# Altium schematic sheet Mosfets.SchDoc
size A4; SheetNumber: 9; SheetTotal: 11
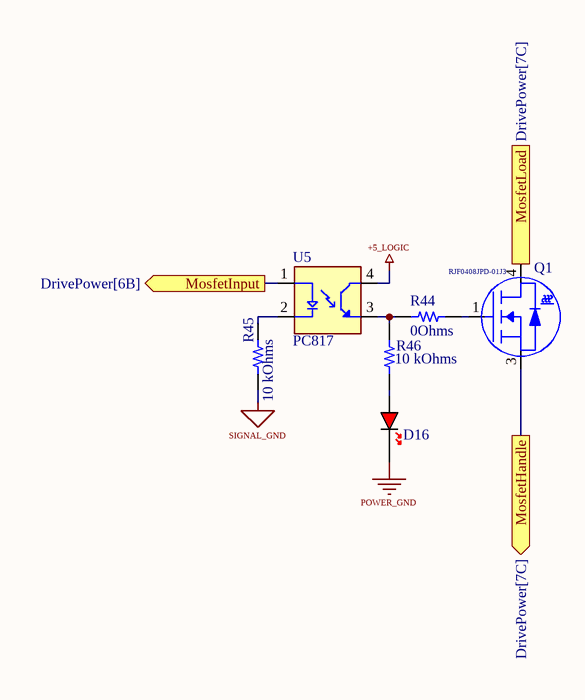
[diagram p0: Mosfets.SchDoc]

## Parts
D16  RED  [LED_0603_RED]  (value not drawn)
Q1  RJF0408JPD-01J3  [DPAKS_SC-63_PRSS0004ZD-C_REN]
R44  0Ohms  [RES 0805_2012]
R45  10 kOhms  [RES 0805_2012]
R46  10 kOhms  [RES 0805_2012]
U5  PC817  [PC817]

## Ports
MosfetHandle (out, see DrivePower[7C]), MosfetInput (out, see DrivePower[6B]), MosfetLoad (in, see DrivePower[7C])

## Nets
+5_LOGIC: U5.4(CT)
POWER_GND: D16.K
SIGNAL_GND: R45.1
MosfetHandle: Q1.3(SOURCE) ; port MosfetHandle
MosfetInput: U5.1(A) ; port MosfetInput
MosfetLoad: Q1.4(DRAIN) ; port MosfetLoad
NetD16_A: D16.A R46.1
NetQ1_1: Q1.1(GATE) R44.2
NetR44_1: R44.1 R46.2 U5.3(ET)
NetR45_2: R45.2 U5.2(C)

## Library data of the parts
D16 = LED_0603_RED: Yellow Plox
Q1 = RJF0408JPD-01J3: No Description Available; Mfr_Name: Renesas Electronics; RefDes: RefDes; Type: Type
R44 = JR0805X35E: 0805 35 AMP JUMPER; Manufacturer: Ohmite; Power (Watts): 0.245W; Part Number: JR0805X35E; Value: 0Ohms; ComponentLink1Description: Datasheet; ComponentLink1URL: https://www.ohmite.com/assets/docs/res_jr.pdf?r=false; ComponentLink2Description: DigiKey Link; ComponentLink2URL: https://www.digikey.com/en/products/detail/ohmite/JR0805X35E/10233372; Composition: Metal Element; Device Package: 0805 (2012 Metric); Height - Seated (Max): 0.022" (0.55mm); LastUpdated: 08/02/2024 21:02:32; Lifecycle Status: Active; Minimum Order: 1; Number of Terminations: 2; Operating Temperature: -55°C ~ 150°C; Package / Case: 0805 (2012 Metric); Packaging: TapeAndReel; PartId: 29311; Part Status: Active; Price: 0.06; Resistance: 0 Ohms; Series: JR; Size / Dimension: 0.079" L x 0.049" W (2.00mm x 1.25mm); Supplier 1: DigiKey; Supplier Part Number 1: JR0805X35ECT-ND; Supplier Device Package: 0805; Tolerance: Jumper
R45 R46 = 2176093-5: RES SMD 10K OHM 0.1% 1/4W 0805; Manufacturer: TE Connectivity Passive Product; Power (Watts): 0.25W, 1/4W; Temperature Coefficient: ±25ppm/°C; Part Number: 2176093-5; Value: 10 kOhms; ComponentLink1Description: Datasheet; ComponentLink1URL: https://www.te.com/commerce/DocumentDelivery/DDEController?Action=srchrtrv&DocNm=1773272&DocType=DS&DocLang=English; ComponentLink2Description: DigiKey Link; ComponentLink2URL: https://www.digikey.com/en/products/detail/te-connectivity-passive-product/2176093-5/4034107; Composition: Thin Film; Device Package: 0805 (2012 Metric); Height - Seated (Max): 0.026" (0.65mm); LastUpdated: 08/02/2024 21:02:35; Lifecycle Status: Active; Minimum Order: 1; Number of Terminations: 2; Operating Temperature: -55°C ~ 155°C; Package / Case: 0805 (2012 Metric); Packaging: TapeAndReel; PartId: 28478; Part Status: Active; Price: 0.14; Resistance: 10 kOhms; Series: RP73P, Holsworthy; Size / Dimension: 0.079" L x 0.049" W (2.00mm x 1.25mm); Supplier 1: DigiKey; Supplier Part Number 1: A110639CT-ND; Supplier Device Package: 0805; Tolerance: ±0.1%
U5 = PC817: Optoisolator Transistor Output 5000Vrms 1 Channel 4-SMD; MP: PC817XI; MF: Sharp Microelectronics; Price: None; Availability: In Stock; Package: SMD-4 Sharp Microelectronics; Value: *; SnapEDA_Link: https://www.snapeda.com/parts/PC817XI/Sharp+Microelectronics/view-part/?ref=snap; Purchase-URL: https://pricing.snapeda.com/search/part/PC817XI/?ref=eda; Check_prices: https://www.snapeda.com/parts/PC817XI/Sharp+Microelectronics/view-part/?ref=eda